# Altium schematic sheet PPGColle.SchDoc
size A3
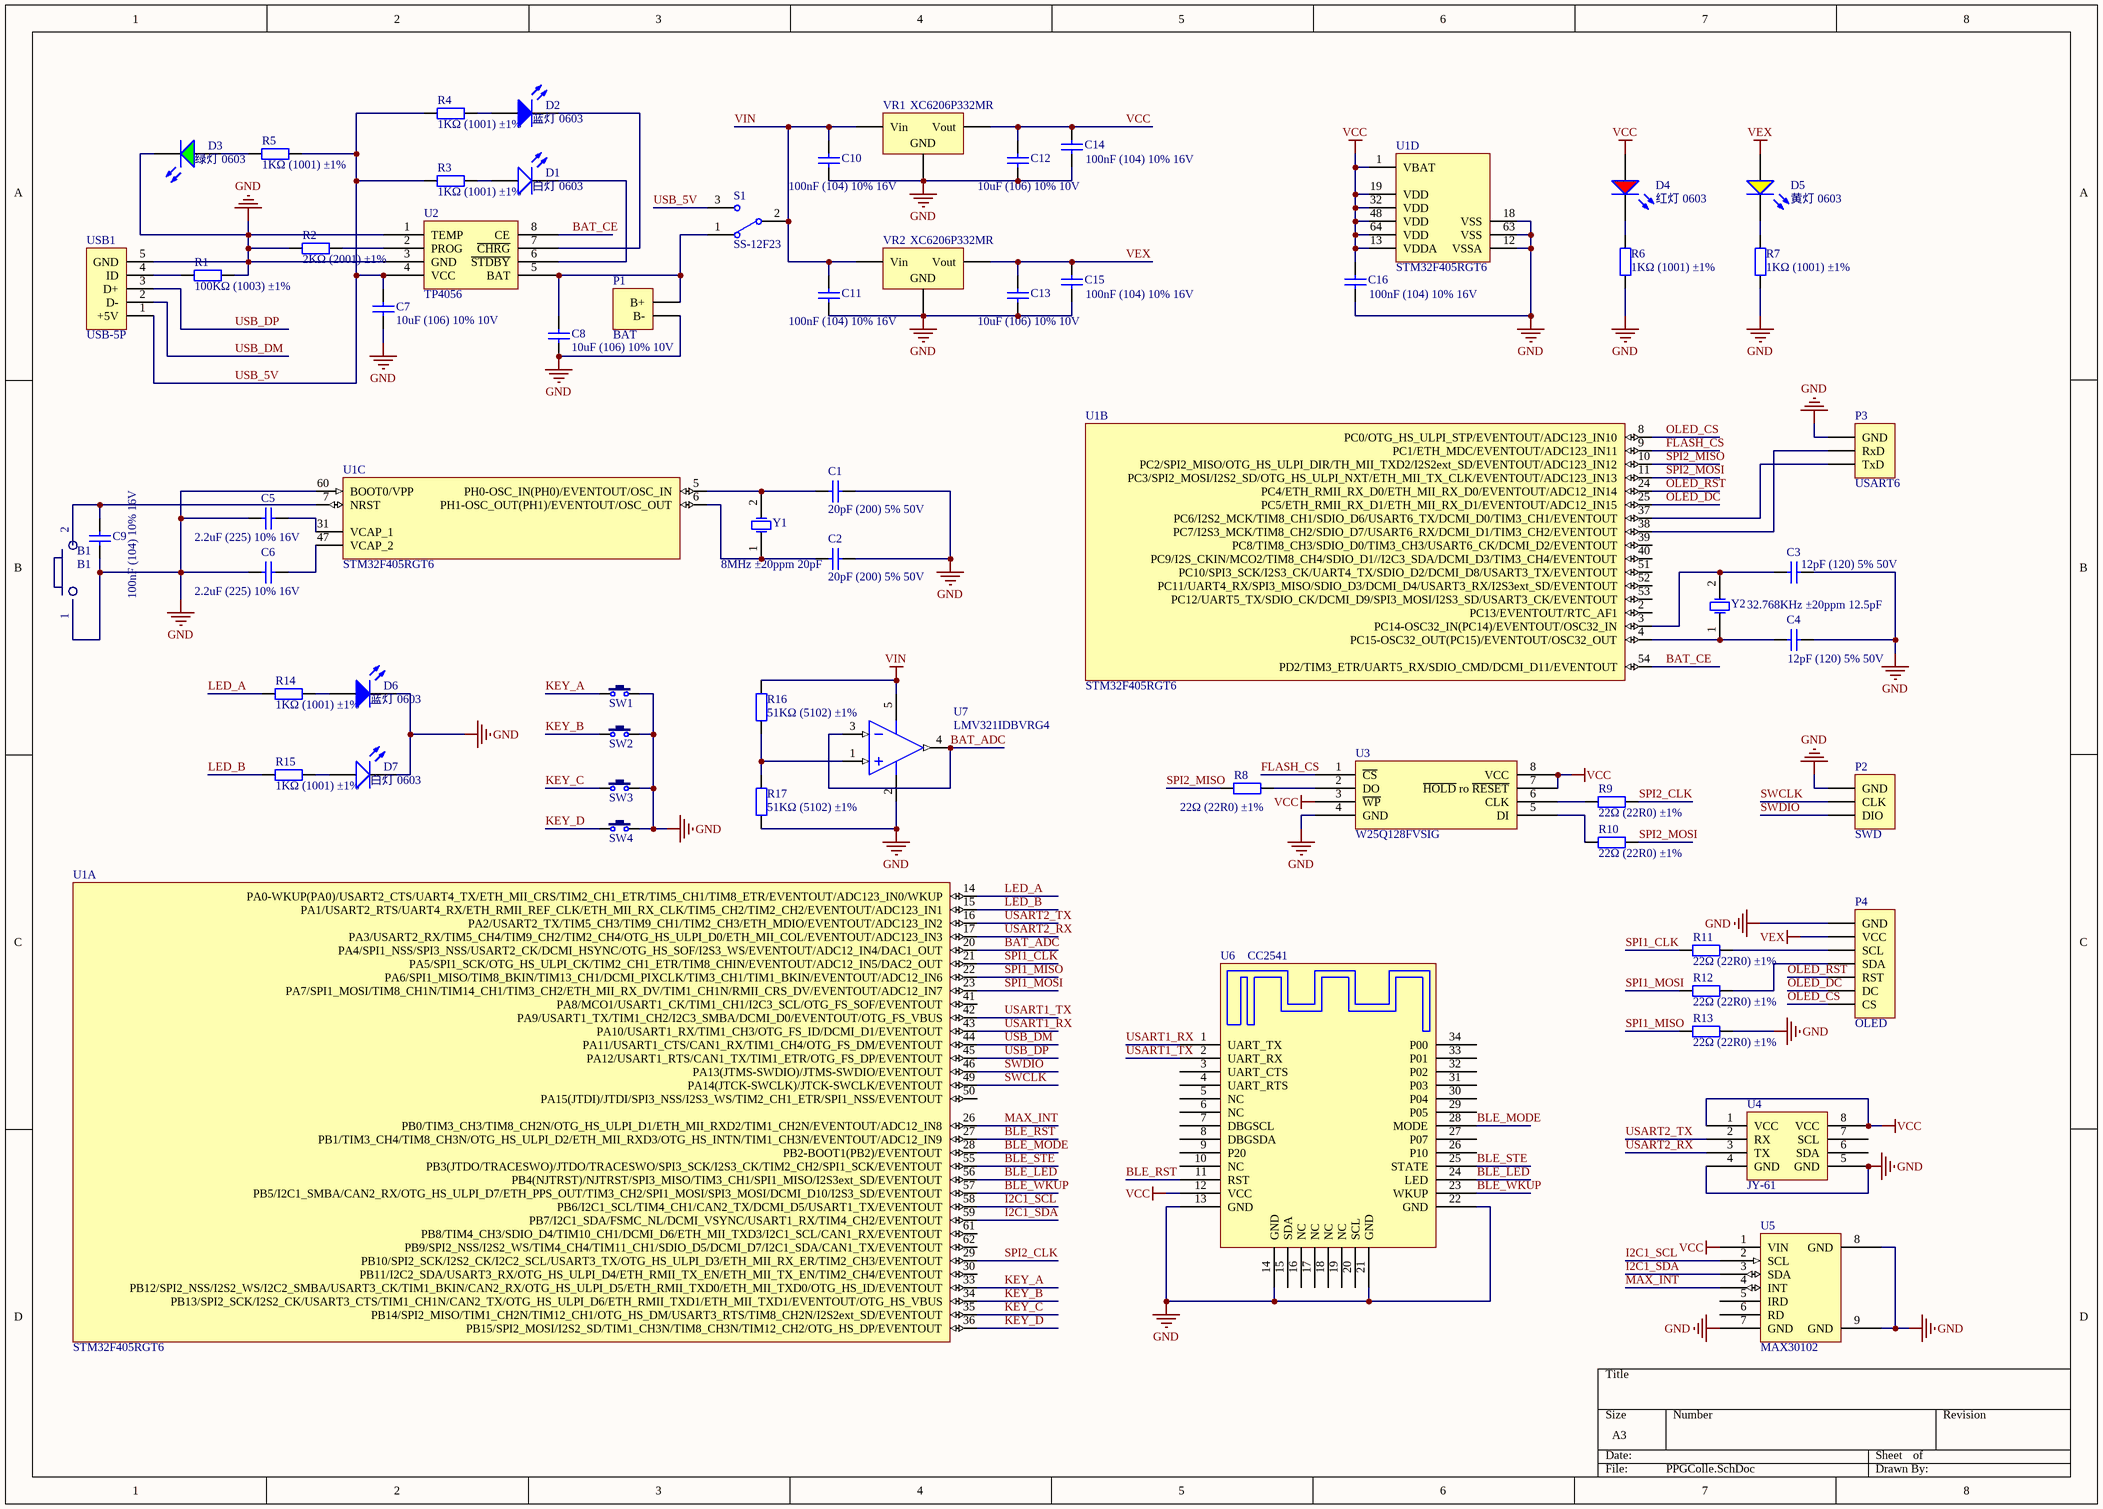
[diagram p0: PPGColle.SchDoc]

## Parts
B1  B1  [MetalButton]
C1  20pF (200) 5% 50V  [0402_C]
C2  20pF (200) 5% 50V  [0402_C]
C3  12pF (120) 5% 50V  [0402_C]
C4  12pF (120) 5% 50V  [0402_C]
C5  2.2uF (225) 10% 16V  [0603_C]
C6  2.2uF (225) 10% 16V  [0603_C]
C7  10uF (106) 10% 10V  [0603_C]
C8  10uF (106) 10% 10V  [0603_C]
C9  100nF (104) 10% 16V  [0402_C]
C10  100nF (104) 10% 16V  [0402_C]
C11  100nF (104) 10% 16V  [0402_C]
C12  10uF (106) 10% 10V  [0603_C]
C13  10uF (106) 10% 10V  [0603_C]
C14  100nF (104) 10% 16V  [0402_C]
C15  100nF (104) 10% 16V  [0402_C]
C16  100nF (104) 10% 16V  [0402_C]
D1  白灯 0603  [0603_LED_S1]
D2  蓝灯 0603  [0603_LED_S1]
D3  绿灯 0603  [0603_LED_S1]
D4  红灯 0603  [0603_LED_S1]
D5  黄灯 0603  [0603_LED_S1]
D6  蓝灯 0603  [0603_LED_S1]
D7  白灯 0603  [0603_LED_S1]
P1  BAT  [HDR1X2]
P2  SWD  [HDR1X3H]
P3  USART6  [HDR1X3H]
P4  OLED  [HDR1X7]
R1  100KΩ (1003) ±1%  [0402_R]
R2  2KΩ (2001) ±1%  [0402_R]
R3  1KΩ (1001) ±1%  [0402_R]
R4  1KΩ (1001) ±1%  [0402_R]
R5  1KΩ (1001) ±1%  [0402_R]
R6  1KΩ (1001) ±1%  [0402_R]
R7  1KΩ (1001) ±1%  [0402_R]
R8  22Ω (22R0) ±1%  [0402_R]
R9  22Ω (22R0) ±1%  [0402_R]
R10  22Ω (22R0) ±1%  [0402_R]
R11  22Ω (22R0) ±1%  [0402_R]
R12  22Ω (22R0) ±1%  [0402_R]
R13  22Ω (22R0) ±1%  [0402_R]
R14  1KΩ (1001) ±1%  [0402_R]
R15  1KΩ (1001) ±1%  [0402_R]
R16  51KΩ (5102) ±1%  [0402_R]
R17  51KΩ (5102) ±1%  [0402_R]
S1  SS-12F23  [SS-12F23]
SW1  3x6x5  [TSW SMD-3*6*4.3]  (value not drawn)
SW2  3x6x5  [TSW SMD-3*6*4.3]  (value not drawn)
SW3  3x6x5  [TSW SMD-3*6*4.3]  (value not drawn)
SW4  3x6x5  [TSW SMD-3*6*4.3]  (value not drawn)
U1  STM32F405RGT6  [LQFP-64_10x10x05P]  (parts A,B,C,D of 4)
U2  TP4056  [SOP-8_EP_150mil]
U3  W25Q128FVSIG  [SOIC-8_208mil]
U4  JY-61  [JY-61]
U5  MAX30102  [MAX30102]
U6  CC2541  [CC2541]
U7  LMV321IDBVRG4  [SOT-23-5]
USB1  USB-5P  [USB-MICRO_D]
VR1  XC6206P332MR  [SOT-23-3L]
VR2  XC6206P332MR  [SOT-23-3L]
Y1  8MHz ±20ppm 20pF  [SMD-5032_2P]
Y2  32.768KHz ±20ppm 12.5pF  [SMD-3215_2P FC - 135]

## Nets
GND: B1.1 C1.2 C2.2 C3.2 C4.2 C5.1 C6.1 C7.1 C8.2 C9.1 C10.1 C11.1 C12.2 C13.2 C14.1 C15.1 C16.1 D3.K D6.K D7.K P1.1(B-) P2.1(GND) P3.1(GND) P4.1(GND) R1.2 R2.1 R6.2 R7.2 R13.2 R17.1 SW1.2 SW2.2 SW3.2 SW4.2 U1.12(VSSA) U1.18(VSS) U1.60(BOOT0/VPP) U1.63(VSS) U2.1(TEMP) U2.3(GND) U3.4(GND) U4.4(GND) U4.5(GND) U5.7(GND) U5.8(GND) U5.9(GND) U6.13(GND) U6.14(GND) U6.21(GND) U6.22(GND) U7.2(V-) USB1.5(GND) VR1.1(GND) VR2.1(GND)
VCC: C12.1 C14.2 C16.2 D4.A U1.1(VBAT) U1.13(VDDA) U1.19(VDD) U1.32(VDD) U1.48(VDD) U1.64(VDD) U3.3(~{WP}) U3.7(~{HOLD}_ro_~{RESET}) U3.8(VCC) U4.1(VCC) U4.8(VCC) U5.1(VIN) U6.12(VCC) VR1.2(Vout)
VEX: C13.1 C15.2 D5.A P4.2(VCC) VR2.2(Vout)
VIN: C10.2 C11.2 R16.2 S1.2 U7.5(V+) VR1.3(Vin) VR2.3(Vin)
BAT_ADC: U1.20(PA4/SPI1_NSS/SPI3_NSS/USART2_CK/DCMI_HSYNC/OTG_HS_SOF/I2S3_WS/EVENTOUT/ADC12_IN4/DAC1_OUT) U7.3(IN-) U7.4(OUT)
BAT_CE: U1.54(PD2/TIM3_ETR/UART5_RX/SDIO_CMD/DCMI_D11/EVENTOUT) U2.8(CE)
BLE_LED: U1.56(PB4(NJTRST)/NJTRST/SPI3_MISO/TIM3_CH1/SPI1_MISO/I2S3ext_SD/EVENTOUT) U6.24(LED)
BLE_MODE: U1.28(PB2-BOOT1(PB2)/EVENTOUT) U6.28(MODE)
BLE_RST: U1.27(PB1/TIM3_CH4/TIM8_CH3N/OTG_HS_ULPI_D2/ETH_MII_RXD3/OTG_HS_INTN/TIM1_CH3N/EVENTOUT/ADC12_IN9) U6.11(RST)
BLE_STE: U1.55(PB3(JTDO/TRACESWO)/JTDO/TRACESWO/SPI3_SCK/I2S3_CK/TIM2_CH2/SPI1_SCK/EVENTOUT) U6.25(STATE)
BLE_WKUP: U1.57(PB5/I2C1_SMBA/CAN2_RX/OTG_HS_ULPI_D7/ETH_PPS_OUT/TIM3_CH2/SPI1_MOSI/SPI3_MOSI/DCMI_D10/I2S3_SD/EVENTOUT) U6.23(WKUP)
FLASH_CS: U1.9(PC1/ETH_MDC/EVENTOUT/ADC123_IN11) U3.1(~{CS})
I2C1_SCL: U1.58(PB6/I2C1_SCL/TIM4_CH1/CAN2_TX/DCMI_D5/USART1_TX/EVENTOUT) U5.2(SCL)
I2C1_SDA: U1.59(PB7/I2C1_SDA/FSMC_NL/DCMI_VSYNC/USART1_RX/TIM4_CH2/EVENTOUT) U5.3(SDA)
KEY_A: SW1.1 U1.33(PB12/SPI2_NSS/I2S2_WS/I2C2_SMBA/USART3_CK/TIM1_BKIN/CAN2_RX/OTG_HS_ULPI_D5/ETH_RMII_TXD0/ETH_MII_TXD0/OTG_HS_ID/EVENTOUT)
KEY_B: SW2.1 U1.34(PB13/SPI2_SCK/I2S2_CK/USART3_CTS/TIM1_CH1N/CAN2_TX/OTG_HS_ULPI_D6/ETH_RMII_TXD1/ETH_MII_TXD1/EVENTOUT/OTG_HS_VBUS)
KEY_C: SW3.1 U1.35(PB14/SPI2_MISO/TIM1_CH2N/TIM12_CH1/OTG_HS_DM/USART3_RTS/TIM8_CH2N/I2S2ext_SD/EVENTOUT)
KEY_D: SW4.1 U1.36(PB15/SPI2_MOSI/I2S2_SD/TIM1_CH3N/TIM8_CH3N/TIM12_CH2/OTG_HS_DP/EVENTOUT)
LED_A: R14.2 U1.14(PA0-WKUP(PA0)/USART2_CTS/UART4_TX/ETH_MII_CRS/TIM2_CH1_ETR/TIM5_CH1/TIM8_ETR/EVENTOUT/ADC123_IN0/WKUP)
LED_B: R15.2 U1.15(PA1/USART2_RTS/UART4_RX/ETH_RMII_REF_CLK/ETH_MII_RX_CLK/TIM5_CH2/TIM2_CH2/EVENTOUT/ADC123_IN1)
MAX_INT: U1.26(PB0/TIM3_CH3/TIM8_CH2N/OTG_HS_ULPI_D1/ETH_MII_RXD2/TIM1_CH2N/EVENTOUT/ADC12_IN8) U5.4(INT)
OLED_CS: P4.7(CS) U1.8(PC0/OTG_HS_ULPI_STP/EVENTOUT/ADC123_IN10)
OLED_DC: P4.6(DC) U1.25(PC5/ETH_RMII_RX_D1/ETH_MII_RX_D1/EVENTOUT/ADC12_IN15)
OLED_RST: P4.5(RST) U1.24(PC4/ETH_RMII_RX_D0/ETH_MII_RX_D0/EVENTOUT/ADC12_IN14)
SPI1_CLK: R11.1 U1.21(PA5/SPI1_SCK/OTG_HS_ULPI_CK/TIM2_CH1_ETR/TIM8_CHIN/EVENTOUT/ADC12_IN5/DAC2_OUT)
SPI1_MISO: R13.1 U1.22(PA6/SPI1_MISO/TIM8_BKIN/TIM13_CH1/DCMI_PIXCLK/TIM3_CH1/TIM1_BKIN/EVENTOUT/ADC12_IN6)
SPI1_MOSI: R12.1 U1.23(PA7/SPI1_MOSI/TIM8_CH1N/TIM14_CH1/TIM3_CH2/ETH_MII_RX_DV/TIM1_CH1N/RMII_CRS_DV/EVENTOUT/ADC12_IN7)
SPI2_CLK: R9.2 U1.29(PB10/SPI2_SCK/I2S2_CK/I2C2_SCL/USART3_TX/OTG_HS_ULPI_D3/ETH_MII_RX_ER/TIM2_CH3/EVENTOUT)
SPI2_MISO: R8.1 U1.10(PC2/SPI2_MISO/OTG_HS_ULPI_DIR/TH_MII_TXD2/I2S2ext_SD/EVENTOUT/ADC123_IN12)
SPI2_MOSI: R10.2 U1.11(PC3/SPI2_MOSI/I2S2_SD/OTG_HS_ULPI_NXT/ETH_MII_TX_CLK/EVENTOUT/ADC123_IN13)
SWCLK: P2.2(CLK) U1.49(PA14(JTCK-SWCLK)/JTCK-SWCLK/EVENTOUT)
SWDIO: P2.3(DIO) U1.46(PA13(JTMS-SWDIO)/JTMS-SWDIO/EVENTOUT)
USART1_RX: U1.43(PA10/USART1_RX/TIM1_CH3/OTG_FS_ID/DCMI_D1/EVENTOUT) U6.1(UART_TX)
USART1_TX: U1.42(PA9/USART1_TX/TIM1_CH2/I2C3_SMBA/DCMI_D0/EVENTOUT/OTG_FS_VBUS) U6.2(UART_RX)
USART2_RX: U1.17(PA3/USART2_RX/TIM5_CH4/TIM9_CH2/TIM2_CH4/OTG_HS_ULPI_D0/ETH_MII_COL/EVENTOUT/ADC123_IN3) U4.3(TX)
USART2_TX: U1.16(PA2/USART2_TX/TIM5_CH3/TIM9_CH1/TIM2_CH3/ETH_MDIO/EVENTOUT/ADC123_IN2) U4.2(RX)
USB_5V: C7.2 R3.2 R4.2 R5.1 S1.3 U2.4(VCC) USB1.1(+5V)
USB_DM: U1.44(PA11/USART1_CTS/CAN1_RX/TIM1_CH4/OTG_FS_DM/EVENTOUT) USB1.2(D-)
USB_DP: U1.45(PA12/USART1_RTS/CAN1_TX/TIM1_ETR/OTG_FS_DP/EVENTOUT) USB1.3(D+)
NetB1_2: B1.2 C9.2 U1.7(NRST)
NetC1_1: C1.1 U1.5(PH0-OSC_IN(PH0)/EVENTOUT/OSC_IN) Y1.2(OSC2)
NetC2_1: C2.1 U1.6(PH1-OSC_OUT(PH1)/EVENTOUT/OSC_OUT) Y1.1(OSC1)
NetC3_1: C3.1 U1.3(PC14-OSC32_IN(PC14)/EVENTOUT/OSC32_IN) Y2.2(OSC2)
NetC4_1: C4.1 U1.4(PC15-OSC32_OUT(PC15)/EVENTOUT/OSC32_OUT) Y2.1(OSC1)
NetC5_2: C5.2 U1.31(VCAP_1)
NetC6_2: C6.2 U1.47(VCAP_2)
NetC8_1: C8.1 P1.2(B+) S1.1 U2.5(BAT)
NetD1_A: D1.A R3.1
NetD1_K: D1.K U2.6(~{STDBY})
NetD2_A: D2.A R4.1
NetD2_K: D2.K U2.7(~{CHRG})
NetD3_A: D3.A R5.2
NetD4_K: D4.K R6.1
NetD5_K: D5.K R7.1
NetD6_A: D6.A R14.1
NetD7_A: D7.A R15.1
NetP3_2: P3.2(RxD) U1.38(PC7/I2S3_MCK/TIM8_CH2/SDIO_D7/USART6_RX/DCMI_D1/TIM3_CH2/EVENTOUT)
NetP3_3: P3.3(TxD) U1.37(PC6/I2S2_MCK/TIM8_CH1/SDIO_D6/USART6_TX/DCMI_D0/TIM3_CH1/EVENTOUT)
NetP4_3: P4.3(SCL) R11.2
NetP4_4: P4.4(SDA) R12.2
NetR1_1: R1.1 USB1.4(ID)
NetR2_2: R2.2 U2.2(PROG)
NetR8_2: R8.2 U3.2(DO)
NetR9_1: R9.1 U3.6(CLK)
NetR10_1: R10.1 U3.5(DI)
NetR16_1: R16.1 R17.2 U7.1(IN+)

Not connected (* = marked no-connect by the designer): U1 2(PC13/EVENTOUT/RTC_AF1) 30(PB11/I2C2_SDA/USART3_RX/OTG_HS_ULPI_D4/ETH_RMII_TX_EN/ETH_MII_TX_EN/TIM2_CH4/EVENTOUT) 39(PC8/TIM8_CH3/SDIO_D0/TIM3_CH3/USART6_CK/DCMI_D2/EVENTOUT) 40(PC9/I2S_CKIN/MCO2/TIM8_CH4/SDIO_D1//I2C3_SDA/DCMI_D3/TIM3_CH4/EVENTOUT) 41(PA8/MCO1/USART1_CK/TIM1_CH1/I2C3_SCL/OTG_FS_SOF/EVENTOUT) 50(PA15(JTDI)/JTDI/SPI3_NSS/I2S3_WS/TIM2_CH1_ETR/SPI1_NSS/EVENTOUT) 51(PC10/SPI3_SCK/I2S3_CK/UART4_TX/SDIO_D2/DCMI_D8/USART3_TX/EVENTOUT) 52(PC11/UART4_RX/SPI3_MISO/SDIO_D3/DCMI_D4/USART3_RX/I2S3ext_SD/EVENTOUT) 53(PC12/UART5_TX/SDIO_CK/DCMI_D9/SPI3_MOSI/I2S3_SD/USART3_CK/EVENTOUT) 61(PB8/TIM4_CH3/SDIO_D4/TIM10_CH1/DCMI_D6/ETH_MII_TXD3/I2C1_SCL/CAN1_RX/EVENTOUT) 62(PB9/SPI2_NSS/I2S2_WS/TIM4_CH4/TIM11_CH1/SDIO_D5/DCMI_D7/I2C1_SDA/CAN1_TX/EVENTOUT); U4 6(SDA) 7(SCL); U5 5(IRD) 6(RD); U6 3(UART_CTS) 4(UART_RTS) 5(NC) 6(NC) 7(DBGSCL) 8(DBGSDA) 9(P20) 10(NC) 15(SDA) 16(NC) 17(NC) 18(NC) 19(NC) 20(SCL) 26(P10) 27(P07) 29(P05) 30(P04) 31(P03) 32(P02) 33(P01) 34(P00)

## Library data of the parts
B1 = MetalButton
C1 C2 = 0402 20pF (200) 5% 50V: 贴片电容; ComponentLink1Description: 供应商链接; ComponentLink1URL: http://www.szlcsc.com/product/details_1906.html; Package: 0402; Supplier: LC; SuppliersPartNumber: C1554
C3 C4 = 0402 12pF (120) 5% 50V: 贴片电容; ComponentLink1Description: 供应商链接; ComponentLink1URL: http://www.szlcsc.com/product/details_1899.html; Package: 0402; Supplier: LC; SuppliersPartNumber: C1547
C5 C6 = 0603 2.2uF (225) 10% 16V: 贴片电容; ComponentLink1Description: 供应商链接; ComponentLink1URL: http://www.szlcsc.com/product/details_24366.html; Package: 0603; Supplier: LC; SuppliersPartNumber: C23630
C7 C8 C12 C13 = 0603 10uF (106) 10% 10V: 贴片电容; ComponentLink1Description: 供应商链接; ComponentLink1URL: http://www.szlcsc.com/product/details_20411.html; Package: 0603; Supplier: LC; SuppliersPartNumber: C19702
C9-C11 C14-C16 = 0402 100nF (104) 10% 16V: 贴片电容; ComponentLink1Description: 供应商链接; ComponentLink1URL: http://www.szlcsc.com/product/details_1877.html; Package: 0402; Supplier: LC; SuppliersPartNumber: C1525
D1 D7 = 0603 白灯: 发光二极管; ComponentLink1Description: 供应商链接; ComponentLink1URL: http://www.szlcsc.com/product/details_2663.html; Package: 0603; Supplier: LC; SuppliersPartNumber: C2290
D2 D6 = 0603 蓝灯: 发光二极管; ComponentLink1Description: 供应商链接; ComponentLink1URL: http://www.szlcsc.com/product/details_73150.html; Package: 0603; Supplier: LC; SuppliersPartNumber: C72041
D3 = 0603 绿灯: 发光二极管; ComponentLink1Description: 供应商链接; ComponentLink1URL: http://www.szlcsc.com/product/details_73152.html; Package: 0603; Supplier: LC; SuppliersPartNumber: C72043
D4 = 0603 红灯: 发光二极管; ComponentLink1Description: 供应商链接; ComponentLink1URL: http://www.szlcsc.com/product/details_2659.html; Package: 0603; Supplier: LC; SuppliersPartNumber: C2286
D5 = 0603 黄灯: 发光二极管; ComponentLink1Description: 供应商链接; ComponentLink1URL: http://www.szlcsc.com/product/details_73147.html; Package: 0603; Supplier: LC; SuppliersPartNumber: C72038
P1 = Header 2: Header, 2-Pin; LatestRevisionDate: 17-Jul-2002; LatestRevisionNote: Re-released for DXP Platform.; Publisher: Altium Limited
P2 P3 = Header 3H: Header, 3-Pin, Right Angle; LatestRevisionDate: 17-Jul-2002; LatestRevisionNote: Re-released for DXP Platform.; Publisher: Altium Limited
P4 = Header 7: Header, 7-Pin; LatestRevisionDate: 17-Jul-2002; LatestRevisionNote: Re-released for DXP Platform.; Publisher: Altium Limited
R1 = 0402 100KΩ (1003) 1%: 贴片电阻; ComponentLink1Description: 供应商链接; ComponentLink1URL: http://www.szlcsc.com/product/details_26484.html; Package: 0402; Supplier: LC; SuppliersPartNumber: C25741
R2 = 0402 2KΩ (2001) 1%: 贴片电阻; ComponentLink1Description: 供应商链接; ComponentLink1URL: http://www.szlcsc.com/product/details_4516.html; Package: 0402; Supplier: LC; SuppliersPartNumber: C4109
R3-R7 R14 R15 = 0402 1KΩ (1001) 1%: 贴片电阻; ComponentLink1Description: 供应商链接; ComponentLink1URL: http://www.szlcsc.com/product/details_12256.html; Package: 0402; Supplier: LC; SuppliersPartNumber: C11702
R8-R13 = 0402 22Ω (22R0) 1%: 贴片电阻; ComponentLink1Description: 供应商链接; ComponentLink1URL: http://www.szlcsc.com/product/details_25835.html; Package: 0402; Supplier: LC; SuppliersPartNumber: C25092
R16 R17 = 0402 51KΩ (5102) 1%: 贴片电阻; ComponentLink1Description: 供应商链接; ComponentLink1URL: http://www.szlcsc.com/product/details_26537.html; Package: 0402; Supplier: LC; SuppliersPartNumber: C25794
S1 = SSW-1P: 1路波动开关; BOM名称: 波动开关; 版权归属: 源创客; 学习资源: www.ooocke.com
SW1-SW4 = TSW 3x6: 3x6轻触开关; 版权归属: 源创客; BOM名称: 3x6轻触开关; 学习资源: www.ooocke.com
U1 = STM32F405RGT6: ARM; ComponentLink1Description: 供应商链接; ComponentLink1URL: http://www.szlcsc.com/product/details_16424.html; Package: LQFP-64_10x10x05P; Supplier: LC; SuppliersPartNumber: C15742
U2 = TP4056_[C16581]: 电池电源管理; ComponentLink1Description: 供应商链接; ComponentLink1URL: http://www.szlcsc.com/product/details_17264.html; Package: SOP-8_EP_150mil; Supplier: LC; SuppliersPartNumber: C16581
U3 = W25Q128FVSIG_[C35101]: Flash ROM; ComponentLink1Description: 供应商链接; ComponentLink1URL: http://www.szlcsc.com/product/details_36072.html; Package: SOIC-8; Supplier: LC; SuppliersPartNumber: C35101
U7 = LMV321IDBVRG4_[C7972]: 运放; ComponentLink1Description: 供应商链接; ComponentLink1URL: http://www.szlcsc.com/product/details_8449.html; Package: SOT-23-5; Supplier: LC; SuppliersPartNumber: C7972
USB1 = USB-5P: 微型USB母座; 版权归属: 源创客; BOM名称: 微型USB母座; 学习资源: www.ooocke.com
VR1 VR2 = SOT-23 XC6206P332MR: 低压差线性稳压(LDO); ComponentLink1Description: 供应商链接; ComponentLink1URL: http://www.szlcsc.com/product/details_5896.html; Package: SOT-23; Supplier: LC; SuppliersPartNumber: C5446
Y1 = SMD-5032_2P 8MHz 20ppm 20pF: 贴片晶振; ComponentLink1Description: 供应商链接; ComponentLink1URL: http://www.szlcsc.com/product/details_117214.html; Package: SMD-5032_2P; Supplier: LC; SuppliersPartNumber: C115962
Y2 = SMD-3215_2P 32.768KHz 20ppm 12.5pF: 贴片晶振; ComponentLink1Description: 供应商链接; ComponentLink1URL: http://www.szlcsc.com/product/details_33310.html; Package: SMD-3215_2P; Supplier: LC; SuppliersPartNumber: C32346